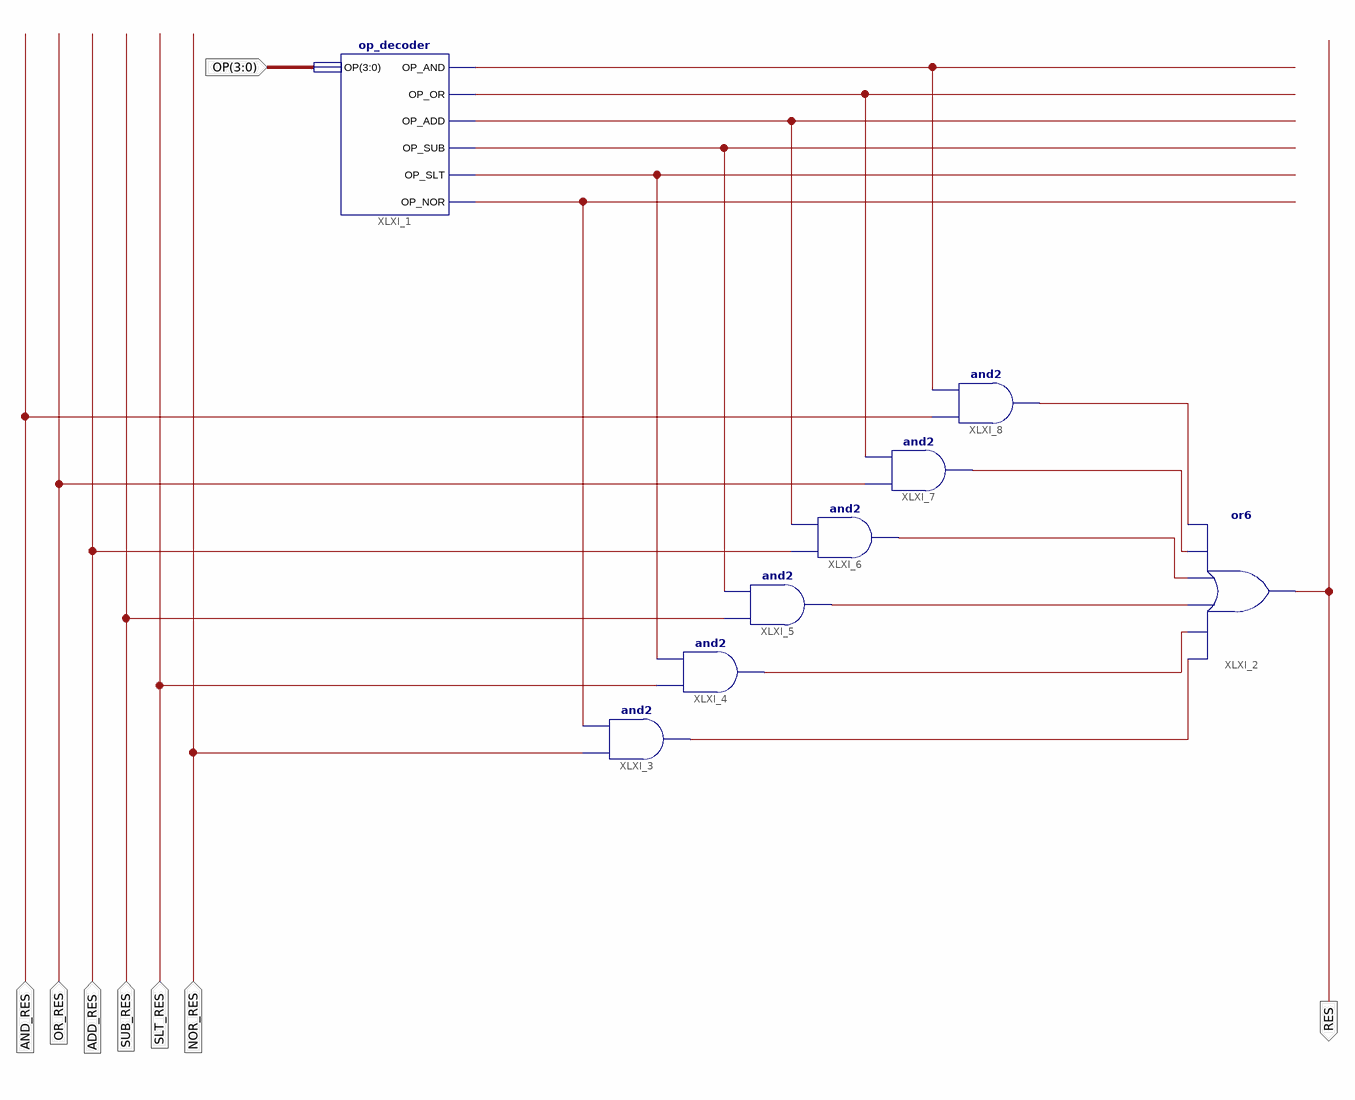
[diagram p0: schematic sheet 1]
// Xilinx ISE schematic op_res_mux1bit.sch (spartan3e) as structural Verilog: 8 symbols, 8 ports
module op_res_mux1bit (
  input  ADD_RES,
  input  SUB_RES,
  input  SLT_RES,
  input  NOR_RES,
  input  [3:0] OP,
  input  AND_RES,
  input  OR_RES,
  output RES
);

  wire XLXN_24, XLXN_25, XLXN_26, XLXN_27, XLXN_28, XLXN_29, XLXN_30, XLXN_31, XLXN_35, XLXN_36, XLXN_37,
       XLXN_38;

  op_decoder XLXI_1 (
    .OP(OP), .OP_AND(XLXN_38), .OP_OR(XLXN_37), .OP_ADD(XLXN_36), .OP_SUB(XLXN_35), .OP_SLT(XLXN_24),
    .OP_NOR(XLXN_25));
  or XLXI_2 (RES, XLXN_26, XLXN_27, XLXN_28, XLXN_29, XLXN_30, XLXN_31);
  and XLXI_8 (XLXN_31, AND_RES, XLXN_38);
  and XLXI_7 (XLXN_30, OR_RES, XLXN_37);
  and XLXI_6 (XLXN_29, ADD_RES, XLXN_36);
  and XLXI_5 (XLXN_28, SUB_RES, XLXN_35);
  and XLXI_4 (XLXN_27, SLT_RES, XLXN_24);
  and XLXI_3 (XLXN_26, NOR_RES, XLXN_25);
endmodule
